# Altium schematic sheet POWER.SchDoc
size A4; SheetNumber: 2; SheetTotal: 2
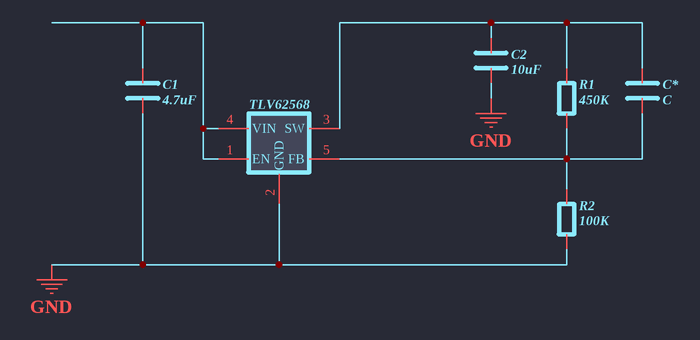
[diagram p0: POWER.SchDoc]

## Parts
C1  4.7uF  [CAP_0603]
C2  10uF  [CAP_0603]
C*  C  [CAP_0603]
R1  450K  [RES_0603]
R2  100K  [RES_0603]
TLV62568  DCDC  [SOT23_5]  (value not drawn)

## Nets
GND: C1.2 C2.1 R2.2 TLV62568.2(GND)
NetC1_1: C1.1 TLV62568.1(EN) TLV62568.4(VIN)
NetC2_2: C2.2 C*.1 R1.1 TLV62568.3(SW)
NetC*_2: C*.2 R1.2 R2.1 TLV62568.5(FB)

## Library data of the parts
C1 C2 C* = C: 电容
R1 R2 = R: 电阻
TLV62568 = DCDC: TI_TL62568